# EAGLE board elasticNode (EAGLE 9.3.1), part 1 of 2
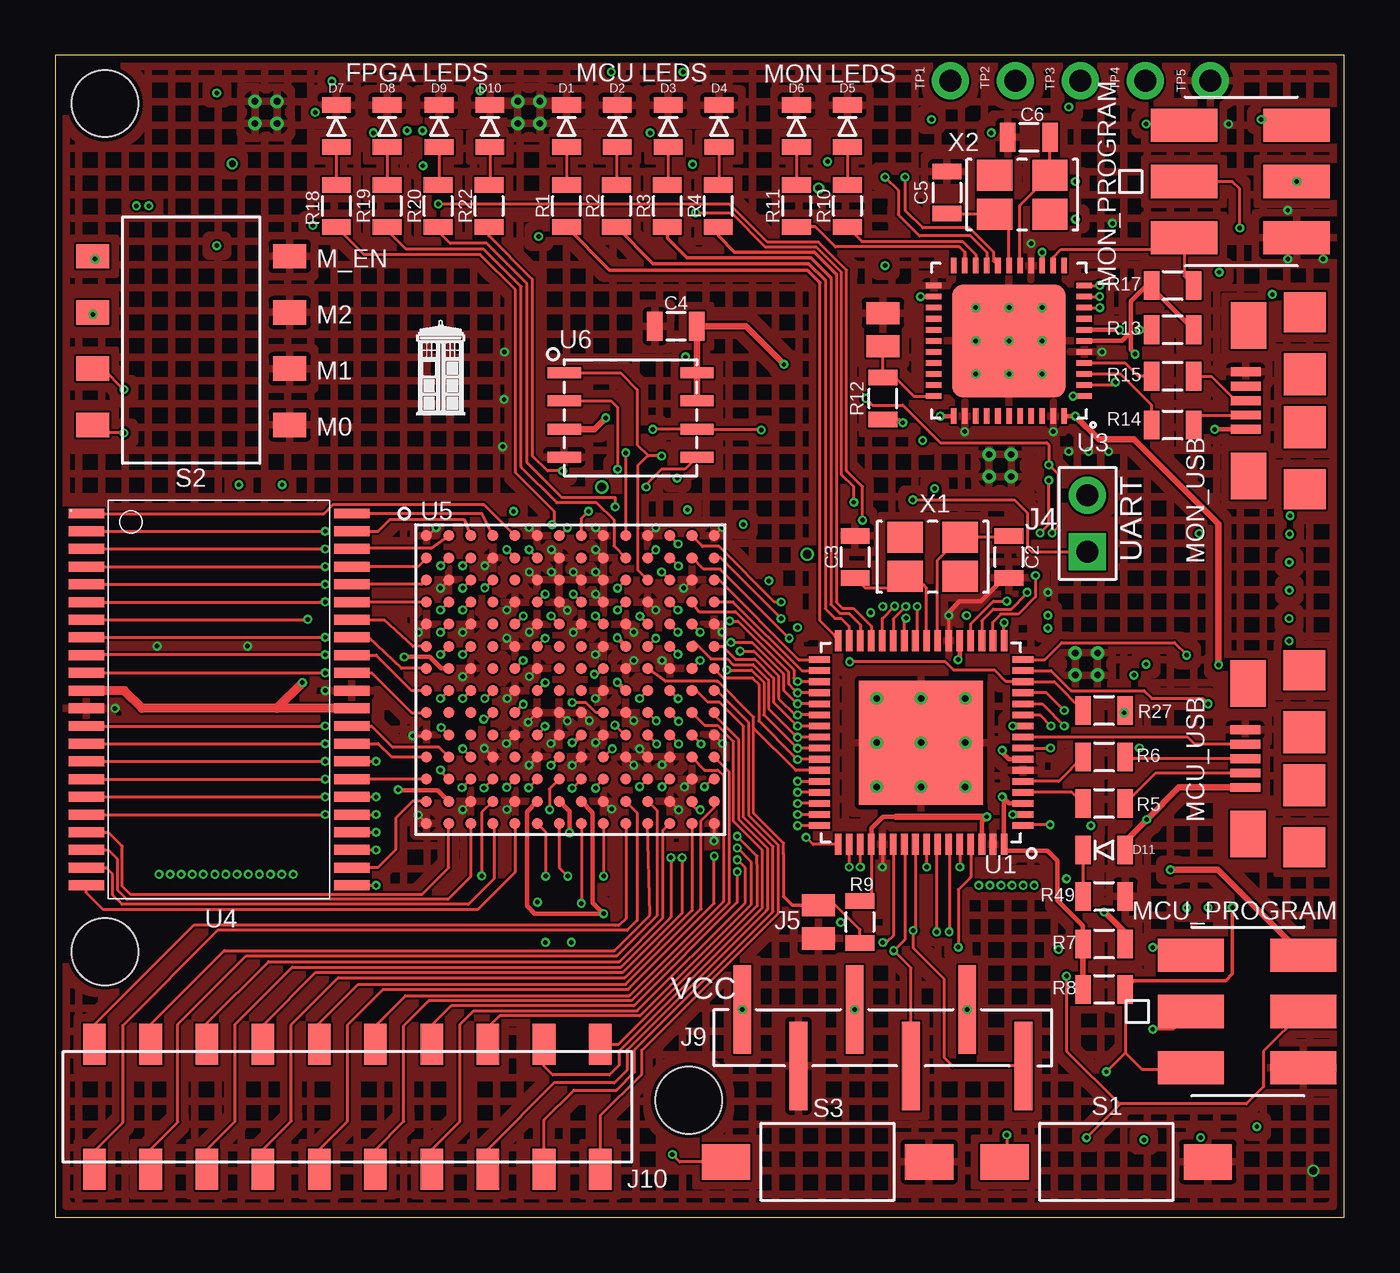
[diagram p5: board, top side]
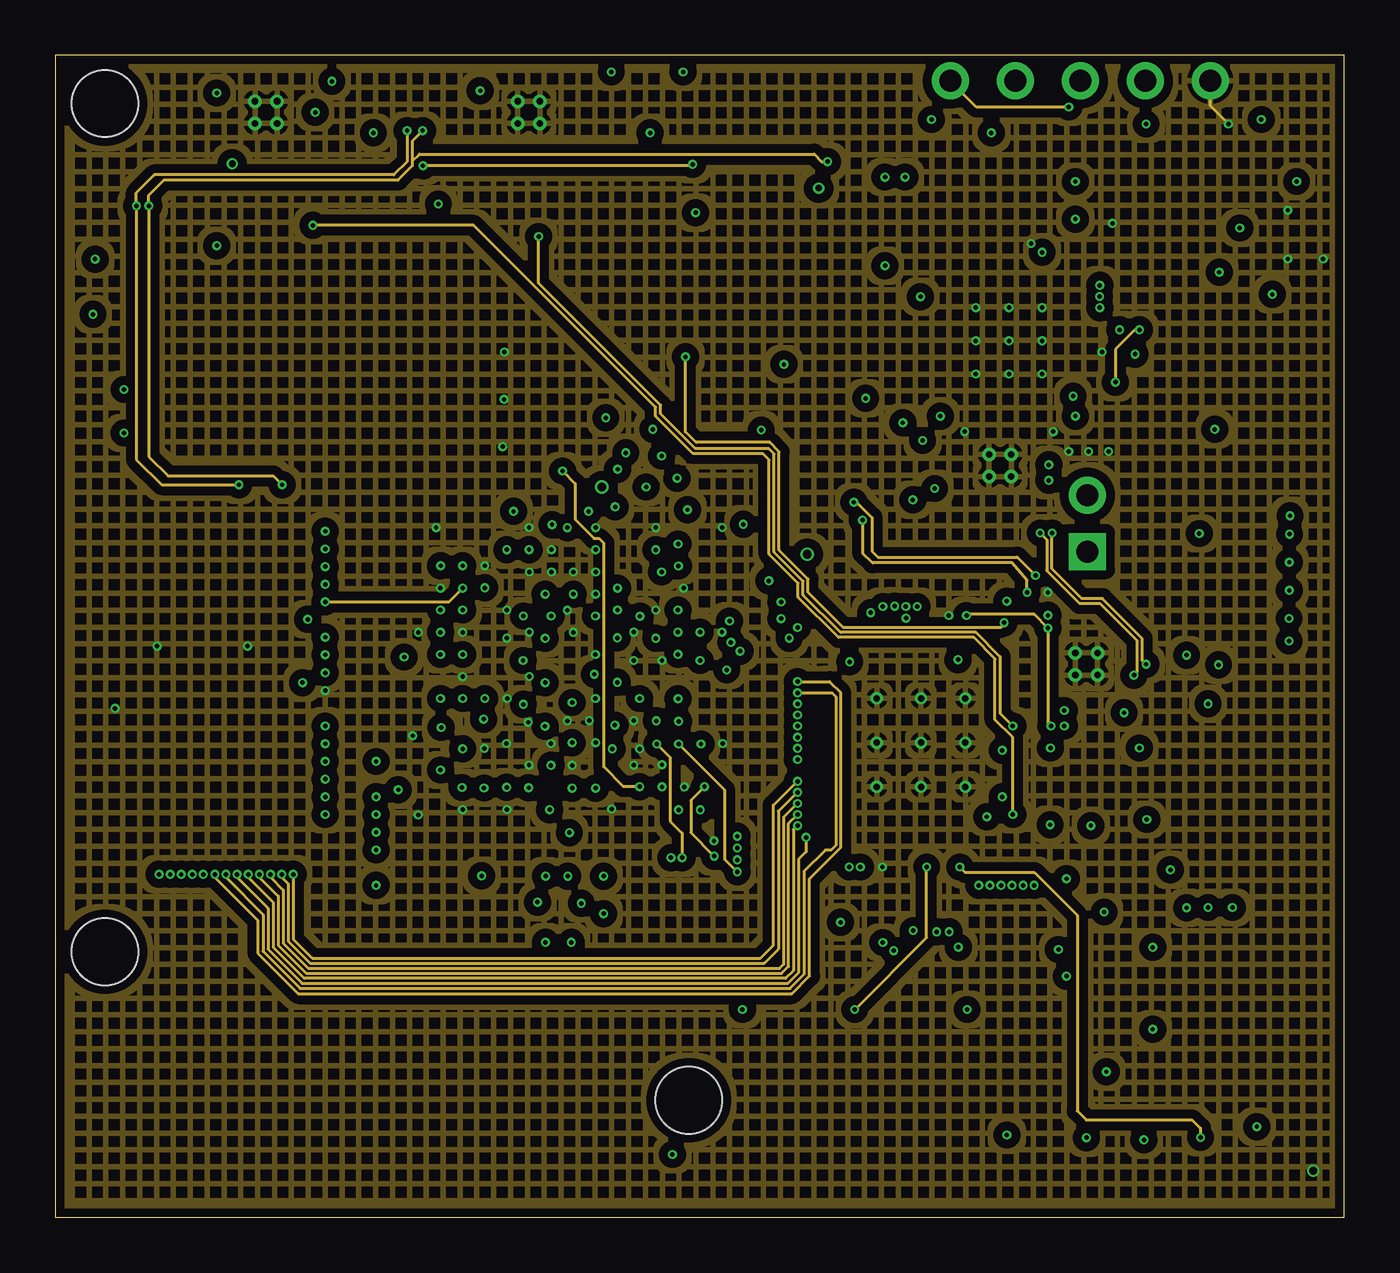
[diagram p6: board, inner layer GroundPlane]
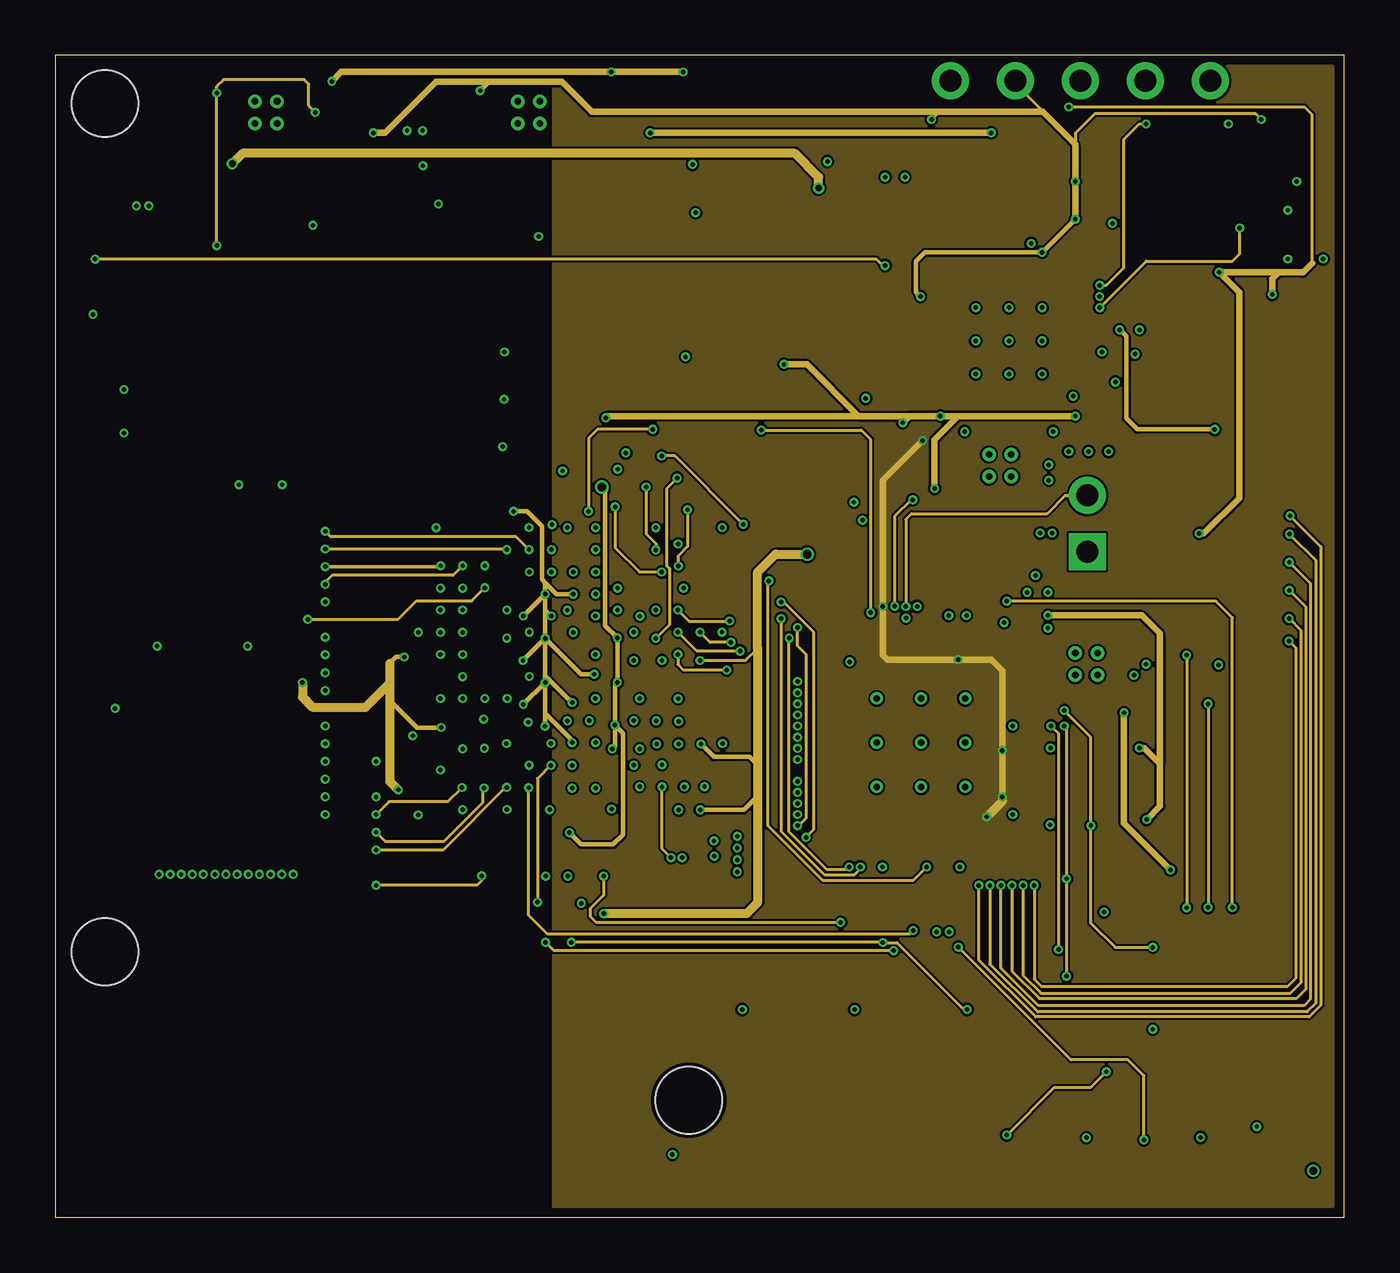
[diagram p7: board, inner layer PowerPlane]
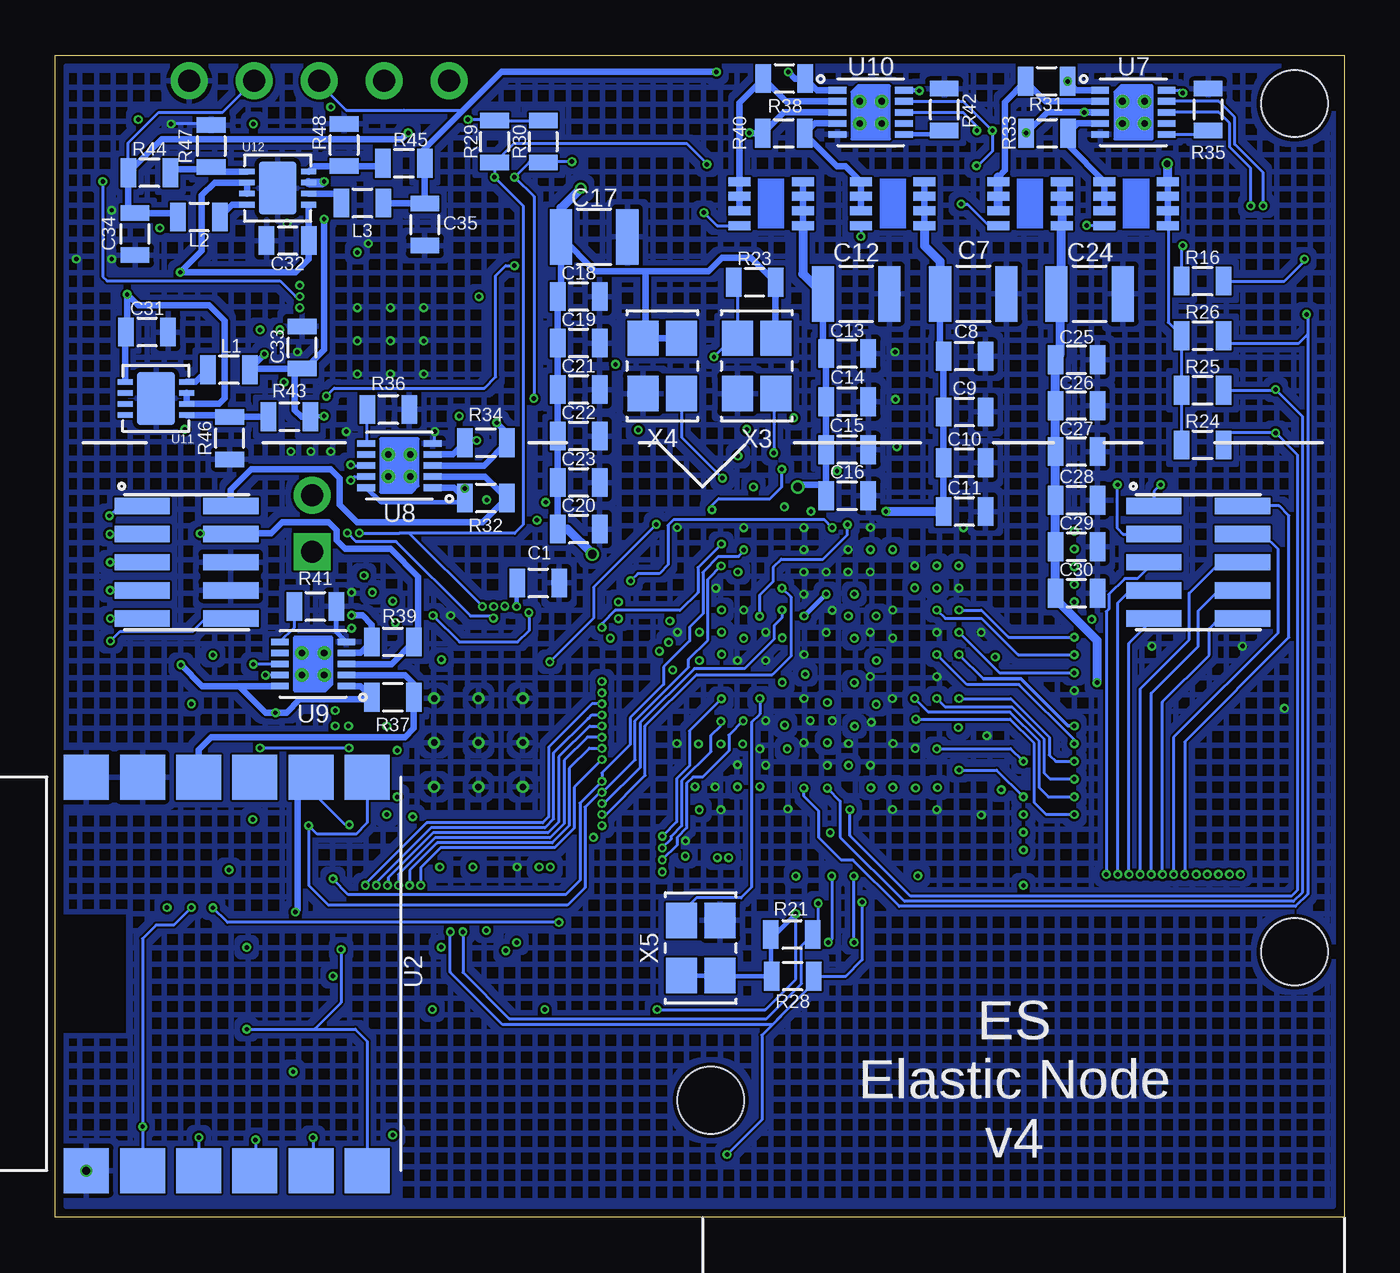
[diagram p8: board, bottom side, seen from below]

Size 58.25 x 52.5 mm. Coordinates in mm from the lower left corner, seen from the top.
Outline: 0,0 58.25,0 58.25,52.5 0,52.5 0,0
Copper layers (1+2*3+16): Top 0.018mm / dielectric 0.36mm / GroundPlane 0.035mm / dielectric 0.71mm / PowerPlane 0.035mm / dielectric 0.36mm / Bottom 0.018mm
Design rules "Multi-CB_4L_100Êm-Tracks_OL35Êm-IL35Êm": minimum track width 0.1mm, minimum drill 0.2mm, track to track 0.1mm, track to pad 0.1mm, pad to pad 0.1mm, via to via 0.1mm, smd to smd 0mil, copper to edge 0.2mm, drill to drill 0.2mm, minimum pad ring 0.125mm, minimum via ring 0.1mm, stop-mask expansion 2mil, vias tented up to drill 0.45mm, thermal gap 0.2mm
Holes 3 mm at 2.24,12 28.63,5.29 2.24,50.32

## Footprints (pad centres in the part's own frame; a part is rotated, then mirrored left to right if it is on the bottom)
0805 = smd 0.7 x 1.3: 1 -0.95,0; 2 0.95,0
1210 = smd 1 x 2.5: 1 -1.5,0; 2 1.5,0
5X2_HEADER_SMT_1.27 = smd 0.74 x 2.5: 1 -2.54,-2; 2 -1.27,-2; 3 0,-2; 4 1.27,-2; 5 2.54,-2; 6 2.54,2; 7 1.27,2; 8 0,2; 9 -1.27,2; 10 -2.54,2
ICSP_SMT = smd 1.5 x 3: 1 -2.54,-2.58; 2 -2.54,2.5; 3 0,-2.58; 4 0,2.5; 5 2.54,-2.58; 6 2.54,2.5
2X1_HEADER = drill 1 pad 1.676 square: 1 0,1.27 | drill 1 pad 1.676: 3 0,-1.27
JUMPER_SMT = smd 1 x 1.5: 1 -0.75,0; 2 0.75,0
USB_MICRO_B_SMT = smd 0.4 x 1.35: 1 -1.3,0; 2 -0.65,0; 3 0,0; 4 0.65,0; 5 1.3,0 | smd 2.1 x 1.6: CASE_1 -3.4,-0.125; CASE_2 3.4,-0.125 | smd 1.8 x 1.9: CASE_3 -4,-2.675; CASE_6 4,-2.675 | smd 1.9 x 1.9: CASE_4 -1.2,-2.675; CASE_5 1.2,-2.675
6X1_JTAG = smd 0.8 x 4: 1 -6.35,1.27; 2 -3.81,-1.27; 3 -1.27,1.27; 4 1.27,-1.27; 5 3.81,1.27; 6 6.35,-1.27
10X2_HEADER_SMT = smd 1.85 x 1.02: 1 2.825,11.43; 2 2.825,8.89; 3 2.825,6.35; 4 2.825,3.81; 5 2.825,1.27; 6 2.825,-1.27; 7 2.825,-3.81; 8 2.825,-6.35; 9 2.825,-8.89; 10 2.825,-11.43; 11 -2.825,-11.43; 12 -2.825,-8.89; 13 -2.825,-6.35; 14 -2.825,-3.81; 15 -2.825,-1.27; 16 -2.825,1.27; 17 -2.825,3.81; 18 -2.825,6.35; 19 -2.825,8.89; 20 -2.825,11.43
POWERPAK1212-8 = smd 0.405 x 0.99: 1 -0.99,-1.435; 2 -0.33,-1.435; 3 0.33,-1.435; 4 0.99,-1.435; 5 0.99,1.435; 6 0.33,1.435; 7 -0.33,1.435; 8 -0.99,1.435
SPST_2PIN_SMT = smd 2.18 x 1.6: 1 -4.59,0; 2 4.59,0
SPST_DIP4_SMT = smd 1.1 x 1.5: 1 -3.83,4.45; 2 -1.29,4.45; 3 1.25,4.45; 4 3.79,4.45; 5 3.79,-4.45; 6 1.25,-4.45; 7 -1.29,-4.45; 8 -3.83,-4.45
THT = drill 1 pad 1.676: 3 0,0
QFN64 = smd 0.95 x 0.3: 1 -4.6,3.75; 2 -4.6,3.25; 3 -4.6,2.75; 4 -4.6,2.25; 5 -4.6,1.75; 6 -4.6,1.25; 7 -4.6,0.75; 8 -4.6,0.25; 9 -4.6,-0.25; 10 -4.6,-0.75; 11 -4.6,-1.25; 12 -4.6,-1.75; 13 -4.6,-2.25; 14 -4.6,-2.75; 15 -4.6,-3.25; 16 -4.6,-3.75; 33 4.6,-3.75; 34 4.6,-3.25; 35 4.6,-2.75; 36 4.6,-2.25; 37 4.6,-1.75; 38 4.6,-1.25; 39 4.6,-0.75; 40 4.6,-0.25; 41 4.6,0.25; 42 4.6,0.75; 43 4.6,1.25; 44 4.6,1.75; 45 4.6,2.25; 46 4.6,2.75; 47 4.6,3.25; 48 4.6,3.75 | smd 0.3 x 0.95: 17 -3.75,-4.6; 18 -3.25,-4.6; 19 -2.75,-4.6; 20 -2.25,-4.6; 21 -1.75,-4.6; 22 -1.25,-4.6; 23 -0.75,-4.6; 24 -0.25,-4.6; 25 0.25,-4.6; 26 0.75,-4.6; 27 1.25,-4.6; 28 1.75,-4.6; 29 2.25,-4.6; 30 2.75,-4.6; 31 3.25,-4.6; 32 3.75,-4.6; 49 3.75,4.6; 50 3.25,4.6; 51 2.75,4.6; 52 2.25,4.6; 53 1.75,4.6; 54 1.25,4.6; 55 0.75,4.6; 56 0.25,4.6; 57 -0.25,4.6; 58 -0.75,4.6; 59 -1.25,4.6; 60 -1.75,4.6; 61 -2.25,4.6; 62 -2.75,4.6; 63 -3.25,4.6; 64 -3.75,4.6 | smd 5.6 x 5.6: PAD 0,0 | drill 0.3: VIA1 -2,2; VIA2 0,2; VIA3 2,2; VIA4 -2,0; VIA5 0,0; VIA6 2,0; VIA7 -2,-2; VIA8 0,-2; VIA9 2,-2
MRF24J40MA = smd 2.032 x 2.032: 1 -8.89,6.35; 2 -8.89,3.81; 3 -8.89,1.27; 4 -8.89,-1.27; 5 -8.89,-3.81; 6 -8.89,-6.35; 7 8.89,-6.35; 8 8.89,-3.81; 9 8.89,-1.27; 10 8.89,1.27; 11 8.89,3.81; 12 8.89,6.35
QFN44 = smd 0.7 x 0.25: 1 -3.4,2.5; 2 -3.4,2; 3 -3.4,1.5; 4 -3.4,1; 5 -3.4,0.5; 6 -3.4,0; 7 -3.4,-0.5; 8 -3.4,-1; 9 -3.4,-1.5; 10 -3.4,-2; 11 -3.4,-2.5; 23 3.4,-2.5; 24 3.4,-2; 25 3.4,-1.5; 26 3.4,-1; 27 3.4,-0.5; 28 3.4,0; 29 3.4,0.5; 30 3.4,1; 31 3.4,1.5; 32 3.4,2; 33 3.4,2.5 | smd 0.25 x 0.7: 12 -2.5,-3.4; 13 -2,-3.4; 14 -1.5,-3.4; 15 -1,-3.4; 16 -0.5,-3.4; 17 0,-3.4; 18 0.5,-3.4; 19 1,-3.4; 20 1.5,-3.4; 21 2,-3.4; 22 2.5,-3.4; 34 2.5,3.4; 35 2,3.4; 36 1.5,3.4; 37 1,3.4; 38 0.5,3.4; 39 0,3.4; 40 -0.5,3.4; 41 -1,3.4; 42 -1.5,3.4; 43 -2,3.4; 44 -2.5,3.4 | smd 5.12 x 5.12: 45 0,0
TSOP44 = smd 1.6 x 0.45: 1 -6,8.4; 2 -6,7.6; 3 -6,6.8; 4 -6,6; 5 -6,5.2; 6 -6,4.4; 7 -6,3.6; 8 -6,2.8; 9 -6,2; 10 -6,1.2; 11 -6,0.4; 12 -6,-0.4; 13 -6,-1.2; 14 -6,-2; 15 -6,-2.8; 16 -6,-3.6; 17 -6,-4.4; 18 -6,-5.2; 19 -6,-6; 20 -6,-6.8; 21 -6,-7.6; 22 -6,-8.4; 23 6,-8.4; 24 6,-7.6; 25 6,-6.8; 26 6,-6; 27 6,-5.2; 28 6,-4.4; 29 6,-3.6; 30 6,-2.8; 31 6,-2; 32 6,-1.2; 33 6,-0.4; 34 6,0.4; 35 6,1.2; 36 6,2; 37 6,2.8; 38 6,3.6; 39 6,4.4; 40 6,5.2; 41 6,6; 42 6,6.8; 43 6,7.6; 44 6,8.4
FTGB196 = smd 0.5 x 0.5: A1 -6.5,6.5; A2 -5.5,6.5; A3 -4.5,6.5; A4 -3.5,6.5; A5 -2.5,6.5; A6 -1.5,6.5; A7 -0.5,6.5; A8 0.5,6.5; A9 1.5,6.5; A10 2.5,6.5; A11 3.5,6.5; A12 4.5,6.5; A13 5.5,6.5; A14 6.5,6.5; B1 -6.5,5.5; B2 -5.5,5.5; B3 -4.5,5.5; B4 -3.5,5.5; B5 -2.5,5.5; B6 -1.5,5.5; B7 -0.5,5.5; B8 0.5,5.5; B9 1.5,5.5; B10 2.5,5.5; B11 3.5,5.5; B12 4.5,5.5; B13 5.5,5.5; B14 6.5,5.5; C1 -6.5,4.5; C2 -5.5,4.5; C3 -4.5,4.5; C4 -3.5,4.5; C5 -2.5,4.5; C6 -1.5,4.5; C7 -0.5,4.5; C8 0.5,4.5; C9 1.5,4.5; C10 2.5,4.5; C11 3.5,4.5; C12 4.5,4.5; C13 5.5,4.5; C14 6.5,4.5; D1 -6.5,3.5; D2 -5.5,3.5; D3 -4.5,3.5; D4 -3.5,3.5; D5 -2.5,3.5; D6 -1.5,3.5; D7 -0.5,3.5; D8 0.5,3.5; D9 1.5,3.5; D10 2.5,3.5; D11 3.5,3.5; D12 4.5,3.5; D13 5.5,3.5; D14 6.5,3.5; E1 -6.5,2.5; E2 -5.5,2.5; E3 -4.5,2.5; E4 -3.5,2.5; E5 -2.5,2.5; E6 -1.5,2.5; E7 -0.5,2.5; E8 0.5,2.5; E9 1.5,2.5; E10 2.5,2.5; E11 3.5,2.5; E12 4.5,2.5; E13 5.5,2.5; E14 6.5,2.5; F1 -6.5,1.5; F2 -5.5,1.5; F3 -4.5,1.5; F4 -3.5,1.5; F5 -2.5,1.5; F6 -1.5,1.5; F7 -0.5,1.5; F8 0.5,1.5; F9 1.5,1.5; F10 2.5,1.5; F11 3.5,1.5; F12 4.5,1.5; F13 5.5,1.5; F14 6.5,1.5; G1 -6.5,0.5; G2 -5.5,0.5; G3 -4.5,0.5; G4 -3.5,0.5; G5 -2.5,0.5; G6 -1.5,0.5; G7 -0.5,0.5; G8 0.5,0.5; G9 1.5,0.5; G10 2.5,0.5; G11 3.5,0.5; G12 4.5,0.5; G13 5.5,0.5; G14 6.5,0.5; H1 -6.5,-0.5; H2 -5.5,-0.5; H3 -4.5,-0.5; H4 -3.5,-0.5; H5 -2.5,-0.5; H6 -1.5,-0.5; H7 -0.5,-0.5; H8 0.5,-0.5; H9 1.5,-0.5; H10 2.5,-0.5; H11 3.5,-0.5; H12 4.5,-0.5; H13 5.5,-0.5; H14 6.5,-0.5; J1 -6.5,-1.5; J2 -5.5,-1.5; J3 -4.5,-1.5; J4 -3.5,-1.5; J5 -2.5,-1.5; J6 -1.5,-1.5; J7 -0.5,-1.5; J8 0.5,-1.5; J9 1.5,-1.5; J10 2.5,-1.5; J11 3.5,-1.5; J12 4.5,-1.5; J13 5.5,-1.5; J14 6.5,-1.5; K1 -6.5,-2.5; K2 -5.5,-2.5; K3 -4.5,-2.5; K4 -3.5,-2.5; K5 -2.5,-2.5; K6 -1.5,-2.5; K7 -0.5,-2.5; K8 0.5,-2.5; K9 1.5,-2.5; K10 2.5,-2.5; K11 3.5,-2.5; K12 4.5,-2.5; K13 5.5,-2.5; K14 6.5,-2.5; L1 -6.5,-3.5; L2 -5.5,-3.5; L3 -4.5,-3.5; L4 -3.5,-3.5; L5 -2.5,-3.5; L6 -1.5,-3.5; L7 -0.5,-3.5; L8 0.5,-3.5; L9 1.5,-3.5; L10 2.5,-3.5; L11 3.5,-3.5; L12 4.5,-3.5; L13 5.5,-3.5; L14 6.5,-3.5; M1 -6.5,-4.5; M2 -5.5,-4.5; M3 -4.5,-4.5; M4 -3.5,-4.5; M5 -2.5,-4.5; M6 -1.5,-4.5; M7 -0.5,-4.5; M8 0.5,-4.5; M9 1.5,-4.5; M10 2.5,-4.5; M11 3.5,-4.5; M12 4.5,-4.5; M13 5.5,-4.5; M14 6.5,-4.5; N1 -6.5,-5.5; N2 -5.5,-5.5; N3 -4.5,-5.5; N4 -3.5,-5.5; N5 -2.5,-5.5; N6 -1.5,-5.5; N7 -0.5,-5.5; N8 0.5,-5.5; N9 1.5,-5.5; N10 2.5,-5.5; N11 3.5,-5.5; N12 4.5,-5.5; N13 5.5,-5.5; N14 6.5,-5.5; P1 -6.5,-6.5; P2 -5.5,-6.5; P3 -4.5,-6.5; P4 -3.5,-6.5; P5 -2.5,-6.5; P6 -1.5,-6.5; P7 -0.5,-6.5; P8 0.5,-6.5; P9 1.5,-6.5; P10 2.5,-6.5; P11 3.5,-6.5; P12 4.5,-6.5; P13 5.5,-6.5; P14 6.5,-6.5
WDFN8 = smd 1.5 x 0.5: 1 -3,1.905; 2 -3,0.635; 3 -3,-0.635; 4 -3,-1.905; 5 3,-1.905; 6 3,-0.635; 7 3,0.635; 8 3,1.905
VDFN10 = smd 0.8 x 0.3: 1 -1.5,1; 2 -1.5,0.5; 3 -1.5,0; 4 -1.5,-0.5; 5 -1.5,-1; 6 1.5,-1; 7 1.5,-0.5; 8 1.5,0; 9 1.5,0.5; 10 1.5,1 | drill 0.3 pad 0.61: P$1 -0.5,0.5; P$2 0.5,0.5; P$3 0.5,-0.5; P$4 -0.5,-0.5
DFN8 = smd 0.25 x 0.68: 1 -0.75,-1.39; 2 -0.25,-1.39; 3 0.25,-1.39; 4 0.75,-1.39; 5 0.75,1.39; 6 0.25,1.39; 7 -0.25,1.39; 8 -0.75,1.39 | smd 2.4 x 1.7: 9 0,0
3.2X2.5_OSC = smd 1.6 x 1.4: 1 -1.25,-0.875; 2 1.25,-0.875; 3 1.25,0.875; 4 -1.25,0.875

## Placement (x,y rotation side)
C1  10u  [0805]  36.42,28.66 0 bottom
C2  20p  [0805]  43.1,29.84 270 top
C3  20p  [0805]  36.15,29.84 90 top
C4  10u  [0805]  28.05,40.26 180 top
C5  20p  [0805]  40.3,46.3 90 top
C6  20p  [0805]  44,48.8 180 top
C7  100u  [1210]  16.76,41.73 0 bottom
C8  4.7u  [0805]  17.16,38.91 0 bottom
C9  4.7u  [0805]  17.16,36.39 0 bottom
C10  0.47u  [0805]  17.16,34.09 0 bottom
C11  0.47u  [0805]  17.16,31.89 0 bottom
C12  47u  [1210]  22.06,41.73 0 bottom
C13  4.7u  [0805]  22.46,39.02 0 bottom
C14  0.47u  [0805]  22.46,36.85 0 bottom
C15  0.47u  [0805]  22.46,34.69 0 bottom
C16  0.47u  [0805]  22.46,32.6 0 bottom
C17  100u  [1210]  33.9,44.3 0 bottom
C18  4.7u  [0805]  34.6,41.6 0 bottom
C19  4.7u  [0805]  34.6,39.5 0 bottom
C20  4.7u  [0805]  34.6,31.1 0 bottom
C21  0.47u  [0805]  34.6,37.4 0 bottom
C22  0.47u  [0805]  34.6,35.3 0 bottom
C23  0.47u  [0805]  34.6,33.2 0 bottom
C24  100u  [1210]  11.5,41.73 0 bottom
C25  4.7u  [0805]  12.1,38.75 0 bottom
C26  4.7u  [0805]  12.1,36.67 0 bottom
C27  4.7u  [0805]  12.1,34.6 0 bottom
C28  0.47u  [0805]  12.1,32.4 0 bottom
C29  0.47u  [0805]  12.1,30.3 0 bottom
C30  0.47u  [0805]  12.1,28.2 0 bottom
C31  10u  [0805]  54.1,40 0 bottom
C32  10u  [0805]  47.75,44.13 180 bottom
C33  22u  [0805]  47.1,39.3 90 bottom
C34  22u  [0805]  54.65,44.42 270 bottom
C35  22u  [0805]  41.55,44.85 90 bottom
D1  GREEN 2.2V  [0805]  23.1,49.3 90 top
D2  GREEN 2.2V  [0805]  25.4,49.3 90 top
D3  GREEN 2.2V  [0805]  27.7,49.3 90 top
D4  GREEN 2.2V  [0805]  30,49.3 90 top
D5  GREEN 2.2V  [0805]  35.8,49.3 90 top
D6  GREEN 2.2V  [0805]  33.5,49.3 90 top
D7  RED 1.8V 2mA  [0805]  12.7,49.3 90 top
D8  RED  [0805]  15,49.3 90 top
D9  RED  [0805]  17.34,49.3 90 top
D10  RED  [0805]  19.64,49.3 90 top
D11  RED  [0805]  47.4,16.6 180 top
J1  FEMALE_HEADER_5X2  [5X2_HEADER_SMT_1.27]  6.6,29.6 270 bottom
J2  FEMALE_HEADER_5X2  [5X2_HEADER_SMT_1.27]  52.32,29.6 270 bottom
J3  ISP_CONN_6PIN  [ICSP_SMT]  53.9,9.3 270 top
J4  FEMALE_HEADER_2X1  [2X1_HEADER]  46.65,31.35 180 top
J5  JUMPER  [JUMPER_SMT]  34.48,13.35 270 top
J6  ISP_CONN_6PIN  [ICSP_SMT]  53.6,46.8 270 top
J7  JUMPER  [JUMPER_SMT]  37.4,40.1 90 top
J8  USB_CONNMICRO_SMT  [USB_MICRO_B_SMT]  53.8,36.9 90 top
J9  JTAG_CONN_6PINSMT  [6X1_JTAG]  37.4,8.12 0 top
J10  FEMALE_HEADER_10X2  [10X2_HEADER_SMT]  13.2,5 270 top
J11  USB_CONNMICRO_SMT  [USB_MICRO_B_SMT]  53.77,20.73 90 top
L1  3.3uH  [0805]  50.4,38.3 180 bottom
L2  3.3uH  [0805]  51.75,45.2 180 bottom
L3  3.3uH  [0805]  44.38,45.83 180 bottom
M1  SISS23DN  [POWERPAK1212-8]  20.4,45.8 270 bottom
M2  SISS23DN  [POWERPAK1212-8]  25.9,45.8 270 bottom
M3  SISS23DN  [POWERPAK1212-8]  9.4,45.8 270 bottom
M4  SISS23DN  [POWERPAK1212-8]  14.2,45.8 270 bottom
R1  550  [0805]  23.1,45.7 90 top
R2  550  [0805]  25.36,45.7 90 top
R3  550  [0805]  27.66,45.7 90 top
R4  550  [0805]  29.96,45.7 90 top
R5  22  [0805]  47.4,18.7 180 top
R6  22  [0805]  47.4,20.8 180 top
R7  2.4k  [0805]  47.4,12.35 0 top
R8  15k  [0805]  47.4,10.3 180 top
R9  10k  [0805]  36.37,13.35 270 top
R10  550  [0805]  35.8,45.7 90 top
R11  550  [0805]  33.5,45.7 90 top
R12  15k  [0805]  37.4,37 90 top
R13  0  [0805]  50.5,40.1 0 top
R14  22  [0805]  50.5,35.8 0 top
R15  22  [0805]  50.5,38 0 top
R16  2.4k  [0805]  6.4,42.3 0 bottom
R17  15k  [0805]  50.5,42.1 0 top
R18  750  [0805]  12.7,45.7 90 top
R19  750  [0805]  15,45.7 90 top
R20  750  [0805]  17.3,45.7 90 top
R21  4.7k  [0805]  24.96,12.78 180 bottom
R22  750  [0805]  19.6,45.7 90 top
R23  15k  [0805]  26.65,42.25 0 bottom
R24  2.4k  [0805]  6.4,34.9 0 bottom
R25  2.4k  [0805]  6.4,37.37 0 bottom
R26  2.4k  [0805]  6.4,39.83 0 bottom
R27  2.4k  [0805]  47.4,22.9 180 top
R28  15k  [0805]  24.93,10.9 180 bottom
R29  1.5k  [0805]  38.4,48.6 90 bottom
R30  1.5k  [0805]  36.2,48.6 90 bottom
R31  0.8  [0805]  13.45,51.33 0 bottom
R32  .8  [0805]  38.8,32.5 180 bottom
R33  0.8  [0805]  13.43,48.98 180 bottom
R34  .8  [0805]  38.8,35 0 bottom
R35  100  [0805]  6.15,50.05 270 bottom
R36  2000  [0805]  43.2,36.5 180 bottom
R37  .8  [0805]  43,23.5 180 bottom
R38  .8  [0805]  25.3,51.45 0 bottom
R39  0.15  [0805]  43,26 0 bottom
R40  .8  [0805]  25.32,48.98 180 bottom
R41  750  [0805]  46.5,27.6 180 bottom
R42  300  [0805]  18.07,50.05 270 bottom
R43  6k8  [0805]  47.67,36.17 0 bottom
R44  10k  [0805]  54,47.2 180 bottom
R45  20k  [0805]  42.5,47.62 180 bottom
R46  1k5  [0805]  50.38,35.2 270 bottom
R47  15k  [0805]  51.2,48.4 90 bottom
R48  10k  [0805]  45.2,48.45 270 bottom
R49  270  [0805]  47.4,14.5 180 top
S1  SPST_BUTTON2PIN_SMT  [SPST_2PIN_SMT]  47.5,2.51 180 top
S2  SPST_DIP_4  [SPST_DIP4_SMT]  6.14,39.63 90 top
S3  SPST_BUTTON2PIN_SMT  [SPST_2PIN_SMT]  34.9,2.51 180 top
TP1  TEST_POINTTHT  [THT]  40.45,51.35 270 top
TP2  TEST_POINTTHT  [THT]  43.39,51.35 270 top
TP3  TEST_POINTTHT  [THT]  46.33,51.35 270 top
TP4  TEST_POINTTHT  [THT]  49.26,51.35 270 top
TP5  TEST_POINTTHT  [THT]  52.2,51.35 270 top
U1  AT90USB128  [QFN64]  39.12,21.45 180 top
U2  MRF24J40MA  [MRF24J40MA]  50.5,11 90 bottom
U3  ATMEGA32U4QFN  [QFN44]  43.1,39.6 180 top
U4  IS66WV51216EALL  [TSOP44]  7.4,23.4 0 top
U5  SPARTAN7-LX15  [FTGB196]  23.27,24.3 0 top
U6  SST26VF032BWDFN  [WDFN8]  26,36.25 0 top
U7  PAC1720  [VDFN10]  9.53,49.92 0 bottom
U8  PAC1720  [VDFN10]  42.7,33.97 180 bottom
U9  PAC1720  [VDFN10]  46.6,25 180 bottom
U10  PAC1720  [VDFN10]  21.4,49.92 0 bottom
U11  LTC3419DFN  [DFN8]  53.7,37 90 bottom
U12  LTC3419DFN  [DFN8]  48.2,46.5 270 bottom
X1  8MHz  [3.2X2.5_OSC]  39.65,29.84 180 top
X2  8MHz  [3.2X2.5_OSC]  43.7,46.2 180 top
X3  100MHz  [3.2X2.5_OSC]  26.55,38.47 270 bottom
X4  50MHz  [3.2X2.5_OSC]  30.82,38.47 270 bottom
X5  32MHz  [3.2X2.5_OSC]  29.08,12.17 90 bottom